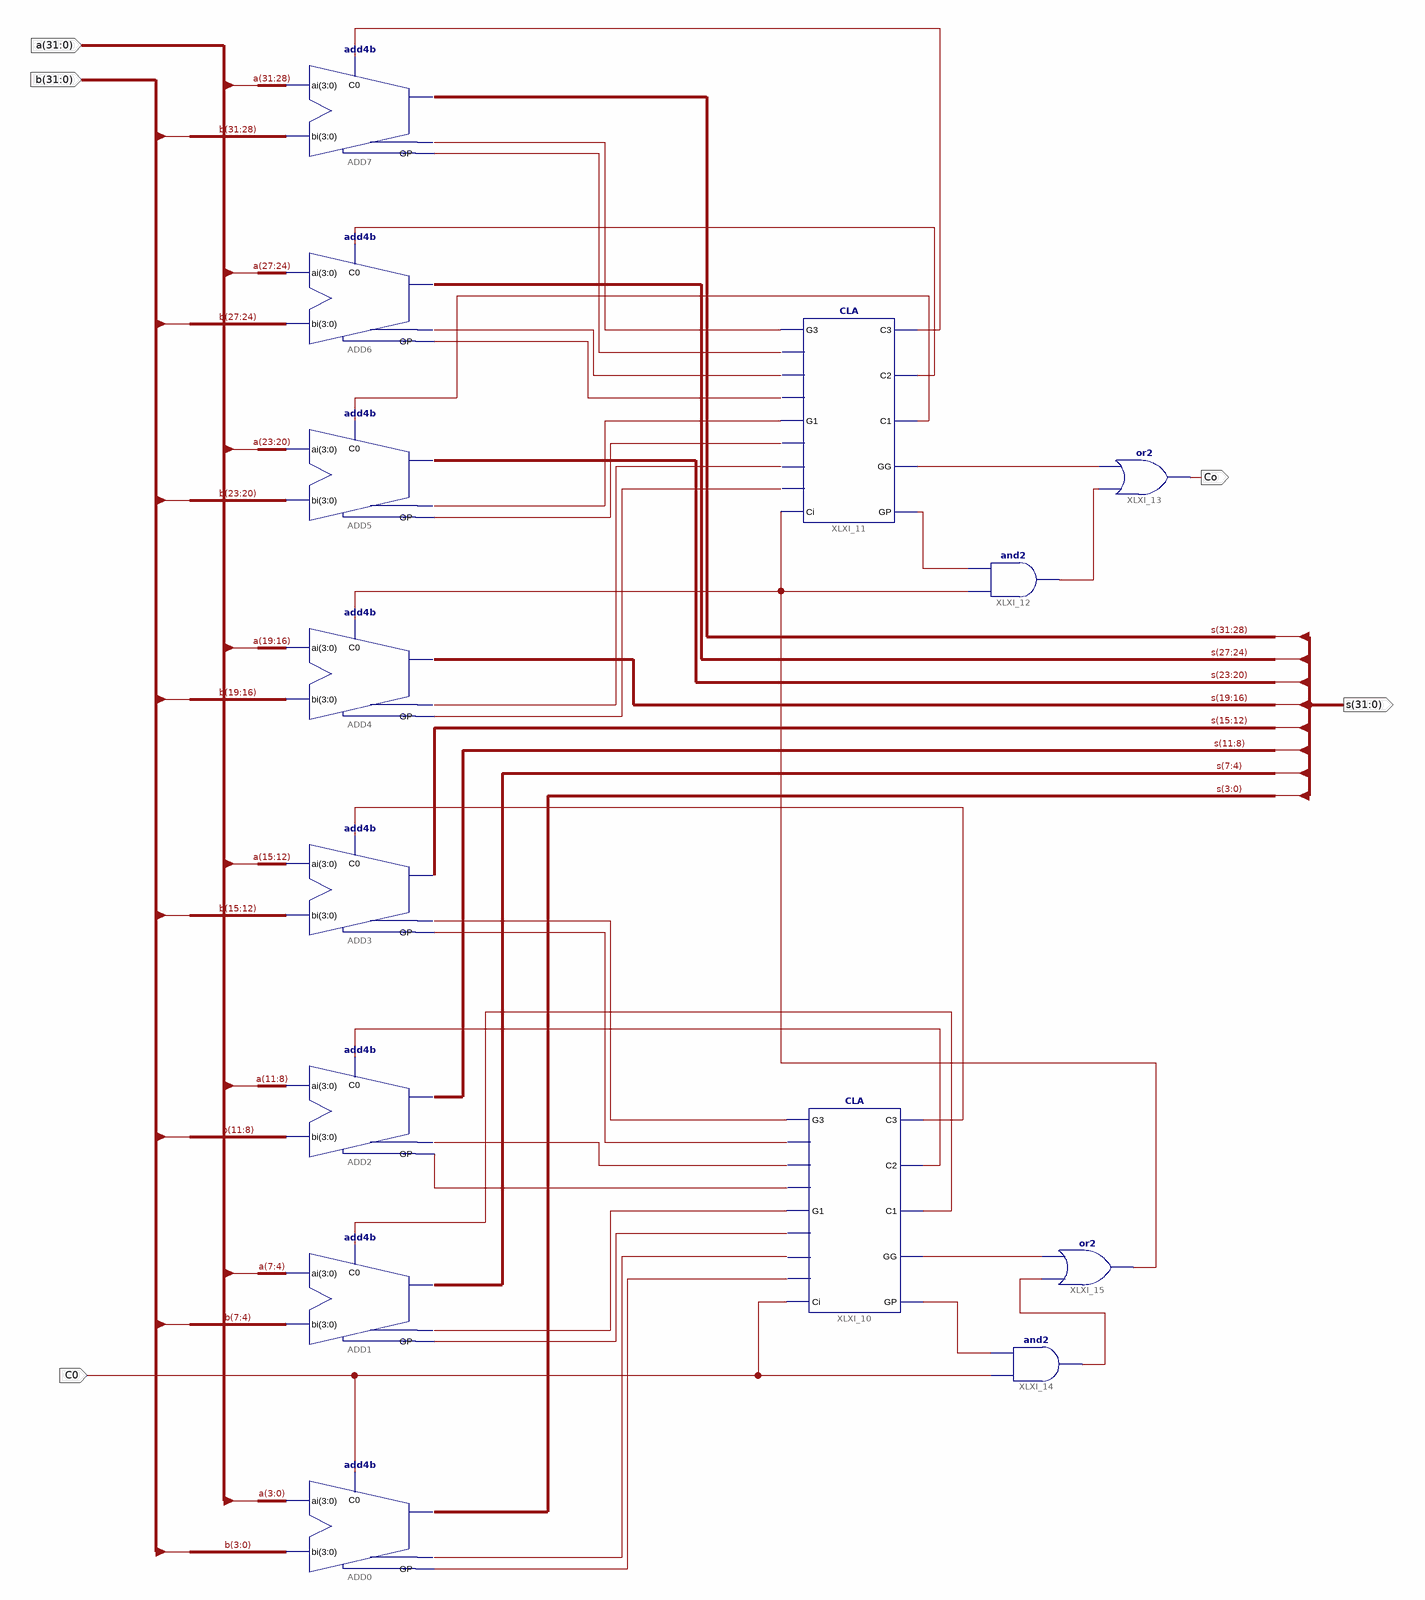
[diagram p0: schematic sheet 1]
// Xilinx ISE schematic ADC32.sch (kintex7) as structural Verilog: 14 symbols, 5 ports
module ADC32 (
  input  [31:0] a,
  input  [31:0] b,
  input  C0,
  output Co,
  output [31:0] s
);

  wire XLXN_22, XLXN_23, XLXN_24, XLXN_30, XLXN_31, XLXN_32, XLXN_33, XLXN_34, XLXN_35, XLXN_36, XLXN_37,
       XLXN_38, XLXN_40, XLXN_41, XLXN_42, XLXN_44, XLXN_45, XLXN_46, XLXN_48, XLXN_49, XLXN_50, XLXN_51,
       XLXN_52, XLXN_53, XLXN_55, XLXN_56, XLXN_57, XLXN_58, XLXN_59;

  add4b ADD7 (.bi(b[31:28]), .ai(a[31:28]), .C0(XLXN_22), .s(s[31:28]), .GG(XLXN_30), .GP(XLXN_31));
  add4b ADD6 (.bi(b[27:24]), .ai(a[27:24]), .C0(XLXN_23), .s(s[27:24]), .GG(XLXN_32), .GP(XLXN_33));
  add4b ADD5 (.bi(b[23:20]), .ai(a[23:20]), .C0(XLXN_24), .s(s[23:20]), .GG(XLXN_34), .GP(XLXN_35));
  add4b ADD4 (.bi(b[19:16]), .ai(a[19:16]), .C0(XLXN_38), .s(s[19:16]), .GG(XLXN_36), .GP(XLXN_37));
  add4b ADD1 (.bi(b[7:4]), .ai(a[7:4]), .C0(XLXN_50), .s(s[7:4]), .GG(XLXN_56), .GP(XLXN_57));
  add4b ADD3 (.bi(b[15:12]), .ai(a[15:12]), .C0(XLXN_48), .s(s[15:12]), .GG(XLXN_51), .GP(XLXN_52));
  add4b ADD2 (.bi(b[11:8]), .ai(a[11:8]), .C0(XLXN_49), .s(s[11:8]), .GG(XLXN_53), .GP(XLXN_55));
  add4b ADD0 (.bi(b[3:0]), .ai(a[3:0]), .C0(C0), .s(s[3:0]), .GG(XLXN_58), .GP(XLXN_59));
  CLA XLXI_10 (
    .G1(XLXN_56), .G3(XLXN_51), .P2(XLXN_55), .G2(XLXN_53), .P3(XLXN_52), .P1(XLXN_57), .G0(XLXN_58),
    .Ci(C0), .P0(XLXN_59), .C3(XLXN_48), .C2(XLXN_49), .C1(XLXN_50), .GG(XLXN_44), .GP(XLXN_46));
  CLA XLXI_11 (
    .G1(XLXN_34), .G3(XLXN_30), .P2(XLXN_33), .G2(XLXN_32), .P3(XLXN_31), .P1(XLXN_35), .G0(XLXN_36),
    .Ci(XLXN_38), .P0(XLXN_37), .C3(XLXN_22), .C2(XLXN_23), .C1(XLXN_24), .GG(XLXN_41), .GP(XLXN_40));
  and XLXI_12 (XLXN_42, XLXN_38, XLXN_40);
  or XLXI_13 (Co, XLXN_42, XLXN_41);
  and XLXI_14 (XLXN_45, C0, XLXN_46);
  or XLXI_15 (XLXN_38, XLXN_45, XLXN_44);
endmodule
